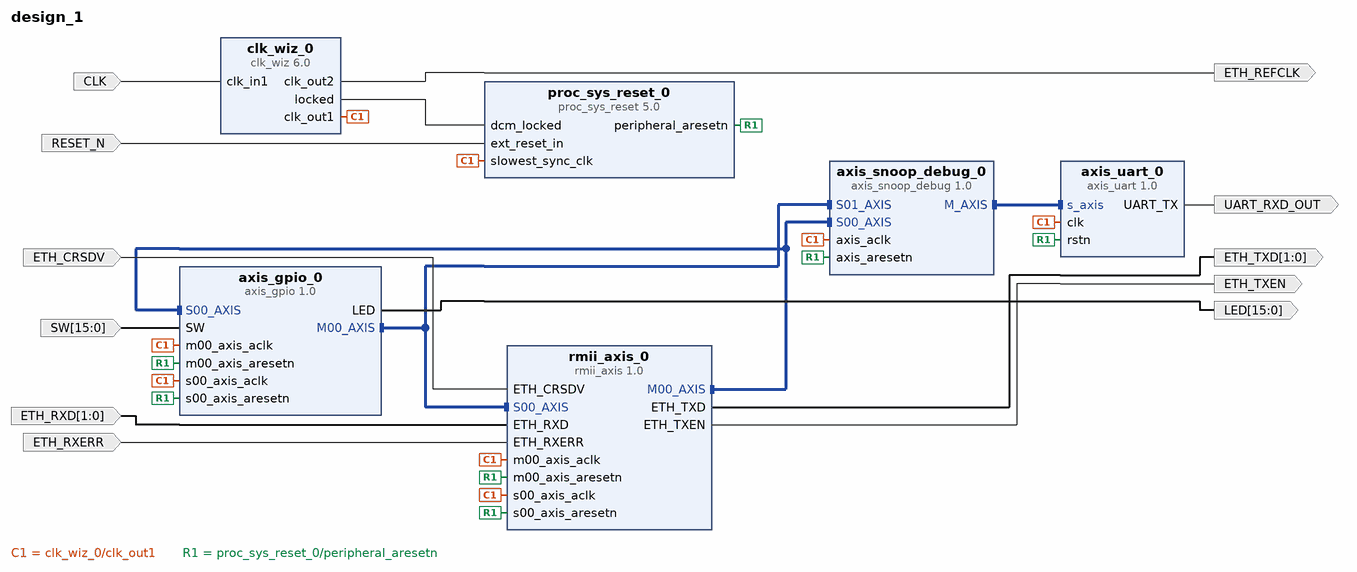
[diagram p0: block diagram of the top level]
# Vivado block design design_1, xc7a100tcsg324-1, Vivado 2024.2.1
create_bd_design design_1

create_bd_port -dir O ETH_TXEN
create_bd_port -dir O -from 1 -to 0 ETH_TXD
create_bd_port -dir I ETH_CRSDV
create_bd_port -dir I ETH_RXERR
create_bd_port -dir I -from 1 -to 0 ETH_RXD
create_bd_port -dir O -from 15 -to 0 LED
create_bd_port -dir I -from 15 -to 0 SW
create_bd_port -dir I -type clk CLK
create_bd_port -dir O -type clk ETH_REFCLK
create_bd_port -dir I -type rst RESET_N
create_bd_port -dir O UART_RXD_OUT

create_bd_cell -type ip -vlnv fpgasforbeginners:toolbox:rmii_axis:1.0 rmii_axis_0
set_property -dict {CONFIG.FPGA_MAC 0xe86a64e7e830 CONFIG.HOST_MAC 0x34298f711e0f} [get_bd_cells rmii_axis_0]
create_bd_cell -type ip -vlnv fpgasforbeginners:toolbox:axis_gpio:1.0 axis_gpio_0
create_bd_cell -type ip -vlnv xilinx.com:ip:clk_wiz:6.0 clk_wiz_0
set_property -dict [list \
  CONFIG.CLKOUT1_JITTER 151.636 \
  CONFIG.CLKOUT1_REQUESTED_OUT_FREQ 50 \
  CONFIG.CLKOUT2_JITTER 151.636 \
  CONFIG.CLKOUT2_PHASE_ERROR 98.575 \
  CONFIG.CLKOUT2_REQUESTED_OUT_FREQ 50 \
  CONFIG.CLKOUT2_REQUESTED_PHASE 45 \
  CONFIG.CLKOUT2_USED true \
  CONFIG.MMCM_CLKOUT0_DIVIDE_F 20.000 \
  CONFIG.MMCM_CLKOUT1_DIVIDE 20 \
  CONFIG.MMCM_CLKOUT1_PHASE 45.000 \
  CONFIG.NUM_OUT_CLKS 2 \
  CONFIG.USE_RESET false \
] [get_bd_cells clk_wiz_0]
create_bd_cell -type ip -vlnv xilinx.com:ip:proc_sys_reset:5.0 proc_sys_reset_0
create_bd_cell -type ip -vlnv fpgasforbeginners:toolbox:axis_snoop_debug:1.0 axis_snoop_debug_0
create_bd_cell -type ip -vlnv fpgasforbeginners:toolbox:axis_uart:1.0 axis_uart_0

# ---- connections ----

connect_bd_intf_net [get_bd_intf_pins axis_gpio_0/M00_AXIS] [get_bd_intf_pins rmii_axis_0/S00_AXIS]
connect_bd_intf_net [get_bd_intf_pins axis_gpio_0/M00_AXIS] [get_bd_intf_pins axis_snoop_debug_0/S01_AXIS]
connect_bd_intf_net [get_bd_intf_pins axis_snoop_debug_0/M_AXIS] [get_bd_intf_pins axis_uart_0/s_axis]
connect_bd_intf_net [get_bd_intf_pins rmii_axis_0/M00_AXIS] [get_bd_intf_pins axis_gpio_0/S00_AXIS]
connect_bd_intf_net [get_bd_intf_pins rmii_axis_0/M00_AXIS] [get_bd_intf_pins axis_snoop_debug_0/S00_AXIS]
connect_bd_net -net ETH_CRSDV_0_1 [get_bd_ports ETH_CRSDV] [get_bd_pins rmii_axis_0/ETH_CRSDV]
connect_bd_net -net ETH_RXD_0_1 [get_bd_ports ETH_RXD] [get_bd_pins rmii_axis_0/ETH_RXD]
connect_bd_net -net ETH_RXERR_0_1 [get_bd_ports ETH_RXERR] [get_bd_pins rmii_axis_0/ETH_RXERR]
connect_bd_net -net SW_0_1 [get_bd_ports SW] [get_bd_pins axis_gpio_0/SW]
connect_bd_net [get_bd_pins axis_gpio_0/LED] [get_bd_ports LED]
connect_bd_net [get_bd_pins axis_uart_0/UART_TX] [get_bd_ports UART_RXD_OUT]
connect_bd_net -net clk_in1_0_1 [get_bd_ports CLK] [get_bd_pins clk_wiz_0/clk_in1]
connect_bd_net [get_bd_pins clk_wiz_0/clk_out1] \
  [get_bd_pins rmii_axis_0/m00_axis_aclk] [get_bd_pins rmii_axis_0/s00_axis_aclk] [get_bd_pins axis_gpio_0/s00_axis_aclk] \
  [get_bd_pins axis_gpio_0/m00_axis_aclk] [get_bd_pins proc_sys_reset_0/slowest_sync_clk] \
  [get_bd_pins axis_snoop_debug_0/axis_aclk] [get_bd_pins axis_uart_0/clk]
connect_bd_net [get_bd_pins clk_wiz_0/clk_out2] [get_bd_ports ETH_REFCLK]
connect_bd_net [get_bd_pins clk_wiz_0/locked] [get_bd_pins proc_sys_reset_0/dcm_locked]
connect_bd_net -net ext_reset_in_0_1 [get_bd_ports RESET_N] [get_bd_pins proc_sys_reset_0/ext_reset_in]
connect_bd_net [get_bd_pins proc_sys_reset_0/peripheral_aresetn] \
  [get_bd_pins rmii_axis_0/s00_axis_aresetn] [get_bd_pins rmii_axis_0/m00_axis_aresetn] \
  [get_bd_pins axis_gpio_0/s00_axis_aresetn] [get_bd_pins axis_gpio_0/m00_axis_aresetn] \
  [get_bd_pins axis_snoop_debug_0/axis_aresetn] [get_bd_pins axis_uart_0/rstn]
connect_bd_net [get_bd_pins rmii_axis_0/ETH_TXD] [get_bd_ports ETH_TXD]
connect_bd_net [get_bd_pins rmii_axis_0/ETH_TXEN] [get_bd_ports ETH_TXEN]

validate_bd_design
save_bd_design
